# Altium project BMS.PrjPcb
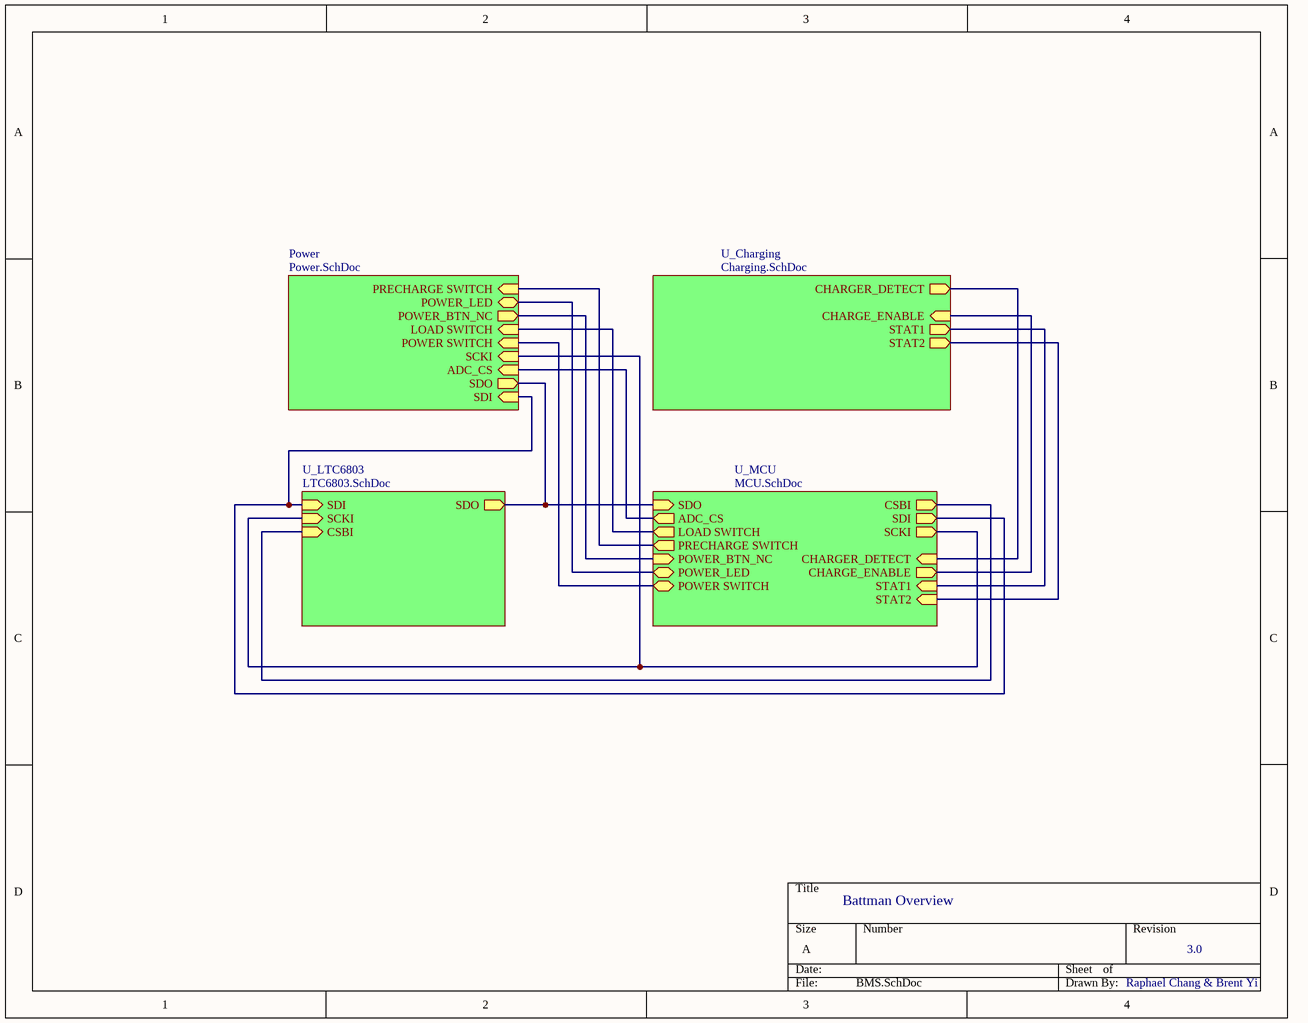
[diagram p0: BMS.SchDoc]
7 sheets, 210 parts. Net scope: hierarchical (ports join the sheet entries above them; power ports are global).
Board file: BMS.PcbDoc
Sheets:
  BMS.SchDoc
    U_LTC6803 = LTC6803.SchDoc
      S12 = Cell.SchDoc
      S11 = Cell.SchDoc
      S10 = Cell.SchDoc
      S9 = Cell.SchDoc
      S8 = Cell.SchDoc
      S7 = Cell.SchDoc
      S6 = Cell.SchDoc
      S5 = Cell.SchDoc
      S4 = Cell.SchDoc
      S3 = Cell.SchDoc
      S2 = Cell.SchDoc
      S1 = Cell.SchDoc
    U_MCU = MCU.SchDoc
    U_Charging = Charging.SchDoc
    Power = Power.SchDoc
      BuckConverter = MAX17502.SchDoc

## Sheet BMS.SchDoc
size A; SheetNumber: 0

### Sub-sheets
Power = Power.SchDoc: PRECHARGE SWITCH (in), POWER_LED, POWER_BTN_NC (out), LOAD SWITCH (in), POWER SWITCH (in), SCKI (in), ADC_CS (in), SDO (out), SDI (in)
U_Charging = Charging.SchDoc: CHARGER_DETECT (out), CHARGE_ENABLE (in), STAT1 (out), STAT2 (out)
U_LTC6803 = LTC6803.SchDoc: SDI (in), SCKI (in), SDO (out), CSBI (in)
U_MCU = MCU.SchDoc: CSBI (out), SDI (out), SDO (in), SCKI (out), CHARGER_DETECT (in), CHARGE_ENABLE (out), STAT1 (in), STAT2 (in), ADC_CS (out), LOAD SWITCH (out), PRECHARGE SWITCH (out), POWER_BTN_NC (in), POWER_LED, POWER SWITCH

### Nets
NetR1_2: sheet U_LTC6803/SCKI, sheet U_MCU/SCKI, sheet Power/SCKI
NetR2_2: sheet U_LTC6803/SDI, sheet U_MCU/SDI, sheet Power/SDI
NetR3_2: sheet U_LTC6803/CSBI, sheet U_MCU/CSBI
NetR50_1: sheet U_MCU/CHARGER_DETECT, sheet U_Charging/CHARGER_DETECT
NetR62_1: sheet U_MCU/POWER_BTN_NC, sheet Power/POWER_BTN_NC
NetR70_1: sheet U_MCU/POWER_LED, sheet Power/POWER_LED
NetU1_43: sheet U_LTC6803/SDO, sheet U_MCU/SDO, sheet Power/SDO
NetU3_12: sheet U_MCU/STAT1, sheet U_Charging/STAT1
NetU3_13: sheet U_MCU/STAT2, sheet U_Charging/STAT2
NetU3_18: sheet U_MCU/PRECHARGE SWITCH, sheet Power/PRECHARGE SWITCH
NetU3_29: sheet U_MCU/CHARGE_ENABLE, sheet U_Charging/CHARGE_ENABLE
NetU3_38: sheet U_MCU/ADC_CS, sheet Power/ADC_CS
NetU3_40: sheet U_MCU/POWER SWITCH, sheet Power/POWER SWITCH
NetU3_41: sheet U_MCU/LOAD SWITCH, sheet Power/LOAD SWITCH

### Notes on the sheet
- Battman Overview
- 3.0
- Raphael Chang & Brent Yi

## Sheet LTC6803.SchDoc
size A
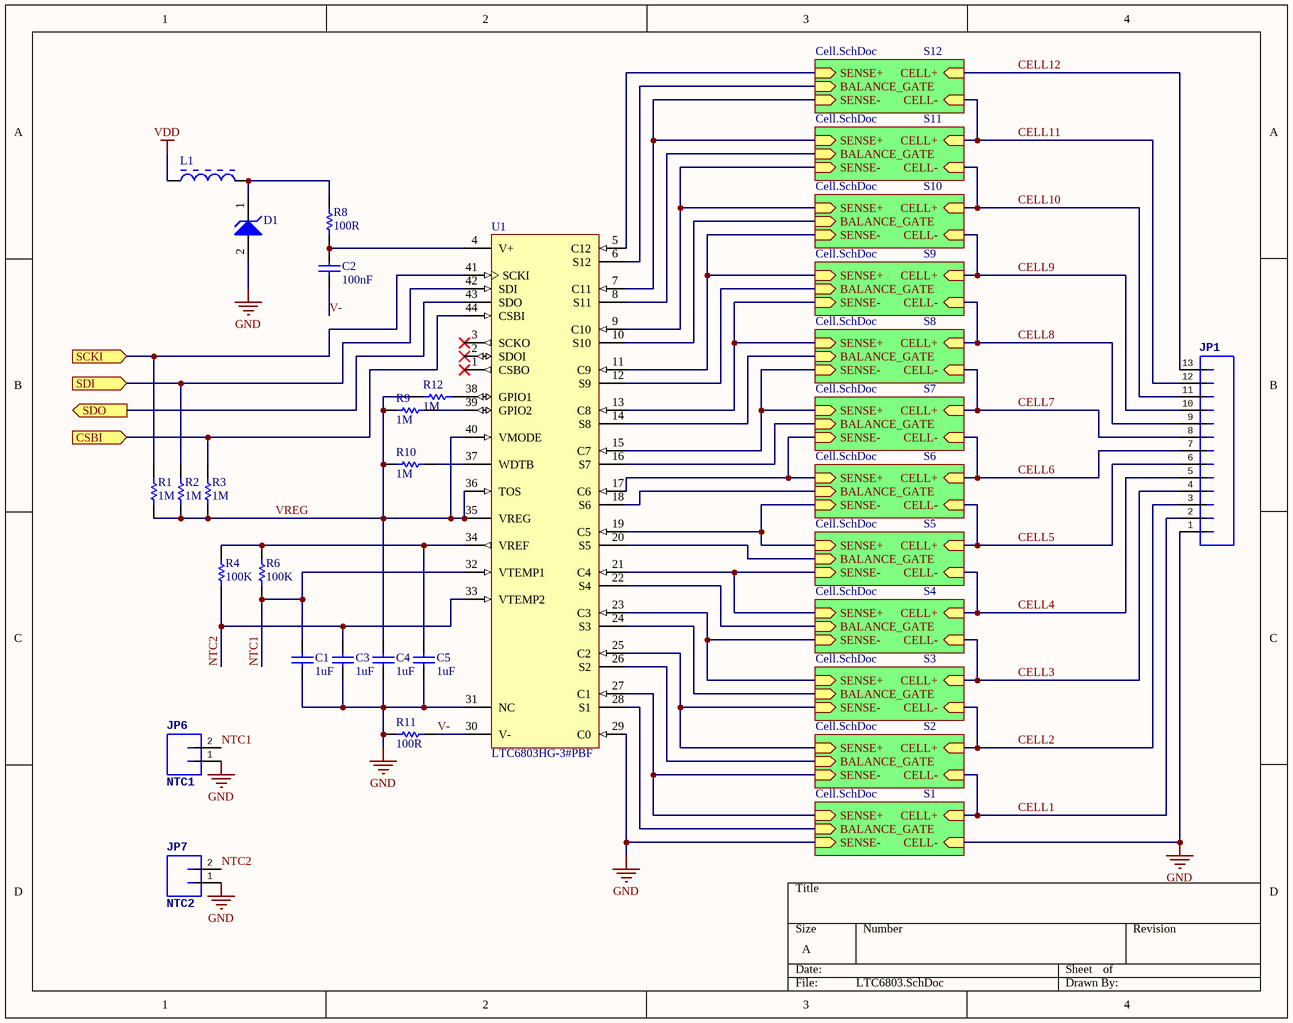
[diagram p1: LTC6803.SchDoc]

### Parts
C1  1uF  [CAPC0603(1608)100_N]
C2  100nF  [CAPC0603(1608)100_L]
C3  1uF  [CAPC0603(1608)100_N]
C4  1uF  [CAPC0603(1608)100_N]
C5  1uF  [CAPC0603(1608)100_N]
D1  (no value)  [SOD-123]
JP1  (no value)  [JST-13-PTH-VERT]
JP6  NTC1  [JST-2-PTH-VERT]
JP7  NTC2  [JST-2-PTH-VERT]
L1  (no value)  [MURA-BLM31-B60-CHIP-2_V3]
R1  1M  [RESC0603(1608)_L]
R2  1M  [RESC0603(1608)_L]
R3  1M  [RESC0603(1608)_L]
R4  100K  [RESC0603(1608)_N]
R6  100K  [RESC0603(1608)_N]
R8  100R  [RESC0603(1608)_L]
R9  1M  [RESC0603(1608)_L]
R10  1M  [RESC0603(1608)_L]
R11  100R  [RESC0603(1608)_L]
R12  1M  [RESC0603(1608)_L]
U1  LTC6803HG-3#PBF  [LT-G-44_L]

### Sub-sheets
S1 = Cell.SchDoc: CELL- (in), SENSE+, SENSE-, BALANCE_GATE (in), CELL+ (in)
S2 = Cell.SchDoc: CELL- (in), SENSE+, SENSE-, BALANCE_GATE (in), CELL+ (in)
S3 = Cell.SchDoc: CELL- (in), SENSE+, SENSE-, BALANCE_GATE (in), CELL+ (in)
S4 = Cell.SchDoc: CELL- (in), SENSE+, SENSE-, BALANCE_GATE (in), CELL+ (in)
S5 = Cell.SchDoc: CELL- (in), SENSE+, SENSE-, BALANCE_GATE (in), CELL+ (in)
S6 = Cell.SchDoc: CELL- (in), SENSE+, SENSE-, BALANCE_GATE (in), CELL+ (in)
S7 = Cell.SchDoc: CELL- (in), SENSE+, SENSE-, BALANCE_GATE (in), CELL+ (in)
S8 = Cell.SchDoc: CELL- (in), SENSE+, SENSE-, BALANCE_GATE (in), CELL+ (in)
S9 = Cell.SchDoc: CELL- (in), SENSE+, SENSE-, BALANCE_GATE (in), CELL+ (in)
S10 = Cell.SchDoc: CELL- (in), SENSE+, SENSE-, BALANCE_GATE (in), CELL+ (in)
S11 = Cell.SchDoc: CELL- (in), SENSE+, SENSE-, BALANCE_GATE (in), CELL+ (in)
S12 = Cell.SchDoc: CELL- (in), SENSE+, SENSE-, BALANCE_GATE (in), CELL+ (in)

### Ports
CSBI (in), SCKI (in), SDI (in), SDO (out)

### Nets
GND: C1.1 C3.1 C4.1 C5.1 D1.2(A) JP1.1 JP6.1 JP7.1 R11.1 U1.29(C0) U1.31(NC) ; sheet S1/CELL-, sheet S1/SENSE-
VDD: L1.1
CELL1: JP1.2 ; sheet S2/CELL-, sheet S1/CELL+
CELL2: JP1.3 ; sheet S3/CELL-, sheet S2/CELL+
CELL3: JP1.4 ; sheet S4/CELL-, sheet S3/CELL+
CELL4: JP1.5 ; sheet S5/CELL-, sheet S4/CELL+
CELL5: JP1.6 ; sheet S6/CELL-, sheet S5/CELL+
CELL6: JP1.7 ; sheet S7/CELL-, sheet S6/CELL+
CELL7: JP1.8 ; sheet S8/CELL-, sheet S7/CELL+
CELL8: JP1.9 ; sheet S9/CELL-, sheet S8/CELL+
CELL9: JP1.10 ; sheet S10/CELL-, sheet S9/CELL+
CELL10: JP1.11 ; sheet S11/CELL-, sheet S10/CELL+
CELL11: JP1.12 ; sheet S12/CELL-, sheet S11/CELL+
CELL12: JP1.13 ; sheet S12/CELL+
NTC1: C1.2 JP6.2 R6.1 U1.32(VTEMP1)
NTC2: C3.2 JP7.2 R4.1 U1.33(VTEMP2)
V-: C2.1 R11.2 U1.30(V-)
VREG: C4.2 R1.1 R2.1 R3.1 R9.1 R10.1 R12.1 U1.35(VREG) U1.36(TOS) U1.40(VMODE)
NetC1_S1_1: U1.27(C1) ; sheet S2/SENSE-, sheet S1/SENSE+
NetC1_S2_1: U1.25(C2) ; sheet S3/SENSE-, sheet S2/SENSE+
NetC1_S3_1: U1.23(C3) ; sheet S4/SENSE-, sheet S3/SENSE+
NetC1_S4_1: U1.21(C4) ; sheet S5/SENSE-, sheet S4/SENSE+
NetC1_S5_1: U1.19(C5) ; sheet S6/SENSE-, sheet S5/SENSE+
NetC1_S6_1: U1.17(C6) ; sheet S7/SENSE-, sheet S6/SENSE+
NetC1_S7_1: U1.15(C7) ; sheet S8/SENSE-, sheet S7/SENSE+
NetC1_S8_1: U1.13(C8) ; sheet S9/SENSE-, sheet S8/SENSE+
NetC1_S9_1: U1.11(C9) ; sheet S10/SENSE-, sheet S9/SENSE+
NetC1_S10_1: U1.9(C10) ; sheet S11/SENSE-, sheet S10/SENSE+
NetC1_S11_1: U1.7(C11) ; sheet S12/SENSE-, sheet S11/SENSE+
NetC1_S12_1: U1.5(C12) ; sheet S12/SENSE+
NetC2_2: C2.2 R8.1 U1.4(V+)
NetC5_2: C5.2 R4.2 R6.2 U1.34(VREF)
NetD1_1: D1.1(K) L1.2 R8.2
NetR1_2: R1.2 U1.41(SCKI) ; port SCKI
NetR2_2: R2.2 U1.42(SDI) ; port SDI
NetR3_2: R3.2 U1.44(CSBI) ; port CSBI
NetR4_S1_1: U1.28(S1) ; sheet S1/BALANCE_GATE
NetR4_S2_1: U1.26(S2) ; sheet S2/BALANCE_GATE
NetR4_S3_1: U1.24(S3) ; sheet S3/BALANCE_GATE
NetR4_S4_1: U1.22(S4) ; sheet S4/BALANCE_GATE
NetR4_S5_1: U1.20(S5) ; sheet S5/BALANCE_GATE
NetR4_S6_1: U1.18(S6) ; sheet S6/BALANCE_GATE
NetR4_S7_1: U1.16(S7) ; sheet S7/BALANCE_GATE
NetR4_S8_1: U1.14(S8) ; sheet S8/BALANCE_GATE
NetR4_S9_1: U1.12(S9) ; sheet S9/BALANCE_GATE
NetR4_S10_1: U1.10(S10) ; sheet S10/BALANCE_GATE
NetR4_S11_1: U1.8(S11) ; sheet S11/BALANCE_GATE
NetR4_S12_1: U1.6(S12) ; sheet S12/BALANCE_GATE
NetR9_2: R9.2 U1.39(GPIO2)
NetR10_2: R10.2 U1.37(WDTB)
NetR12_2: R12.2 U1.38(GPIO1)
NetU1_43: U1.43(SDO) ; port SDO

Not connected (* = marked no-connect by the designer): U1 1(CSBO)* 2(SDOI)* 3(SCKO)*

### Library data of the parts
C1 C3-C5 = CMP-1035-02730-1: CAP 1uF 6.3V Â±10% 0603 (1608 Metric) Thickness 1mm SMD; Case-EIA: 0603; Case-Metric: 1608; Rated Voltage: 6.3 V; Max Thickness: 1 mm; Technology: SMT; Tolerance: Â±10%; Value: 1uF
C2 = CMP-1035-02595-1: CAP 100nF 100V Â±10% 0603 (1608 Metric) Thickness 1mm SMD; Case-EIA: 0603; Case-Metric: 1608; Tolerance: Â±10%; Rated Voltage: 100 V; Value: 100nF; Technology: SMT; Max Thickness: 1 mm
D1 = CMHZ5265B
JP1 = JST_XH_13
JP6 JP7 = JST_2_VERT
L1 = MURA-FB-2
R1-R3 R9 R10 R12 = CMP-1012-00849-1: 1M 0.1W 1% 0603 (1608 Metric)  SMD; Value: 1000000.00 Ohm; Case-EIA: 0603; Case-Metric: 1608; Power: 0.1 W; Tolerance: 1 %; Technology: SMT
R4 R6 = CMP-1012-00122-1: 100K 0.1W 5% 0603 (1608 Metric)  SMD; Case-EIA: 0603; Value: 100000.00 Ohm; Case-Metric: 1608; Tolerance: 5 %; Power: 0.1 W; Technology: SMT
R8 R11 = CMP-1012-00050-1: 100R 0.1W 5% 0603 (1608 Metric)  SMD; Case-EIA: 0603; Value: 100.00 Ohm; Case-Metric: 1608; Tolerance: 5 %; Technology: SMT; Power: 0.1 W
U1 = CMP-0471-00238-1: Multicell Battery Stack Monitor, 60 V Vin MAX, 44-pin SOP (G-44), -40 to 125 degC, Pb-Free; Manufacturer: Linear Technology; Number of Cells: > 1000 V of stacked Li-Ion cells; Vin Max(V): 60; Battery Chemistry: Li-Ion, Supercapacitors, Multi-Chemistry; ComponentLink2URL: http://cds.linear.com/docs/en/datasheet/680313fa.pdf; ComponentLink1URL: http://www.linear.com/; PackageReference: G-44; DatasheetVersion: Rev. A; RoHS: TRUE; Mounting Technology: Surface Mount; ComponentLink3Description: Package Specification; PartNumber: LTC6803HG-3#PBF; Type of Charger: Battery Stack Monitor; PackageVersion: Rev. Ã˜, 06/2010; ComponentLink1Description: Manufacturer URL; PackageDescription: 44-Pin Plastic SSOP, Body 12.8 x 5.3 mm, Pitch 0.5 mm; ComponentLink3URL: http://cds.linear.com/docs/en/packaging/SSOP_44_05-08-1754.pdf; ComponentLink2Description: Datasheet

## Sheet Cell.SchDoc
size A; SheetNumber: 5
Used 12 times, as channels U_LTC6803/S12, U_LTC6803/S11, U_LTC6803/S10, U_LTC6803/S9, U_LTC6803/S8, U_LTC6803/S7, U_LTC6803/S6, U_LTC6803/S5, U_LTC6803/S4, U_LTC6803/S3, U_LTC6803/S2, U_LTC6803/S1. Parts and nets are listed once, with the designators drawn on the sheet.
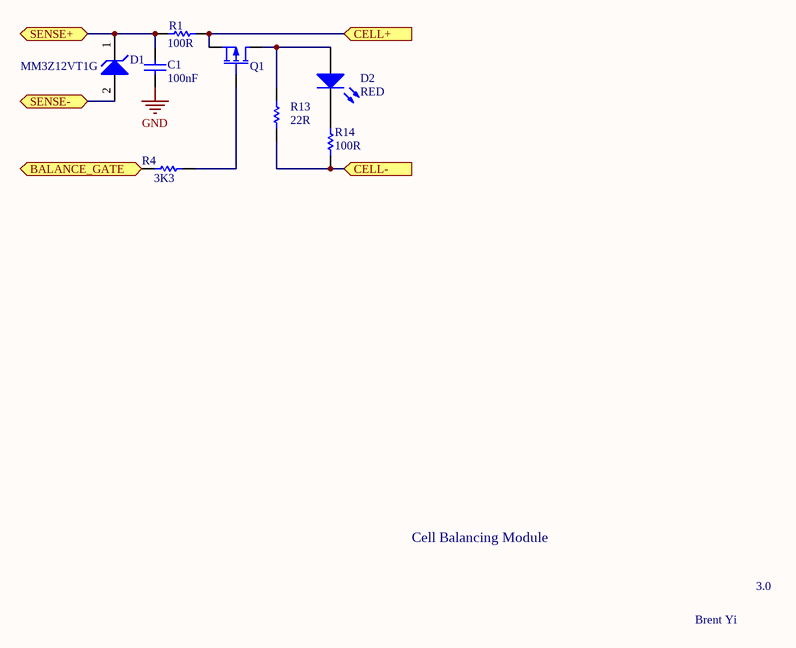
[diagram p2: Cell.SchDoc]

### Parts
C1  100nF  [CAPC0603(1608)100_M]
D1  MM3Z12VT1G  [ONSC-SOD-323-2-477-02_V]
D2  RED  [0603_A]
Q1  SI2365  [SOT23-3]  (value not drawn)
R1  100R  [RESC0603(1608)_N]
R4  3K3  [RESC0603(1608)_N]
R13  value 22R  [RESC2512(6432)_N]
R14  100R  [RESC0603(1608)_N]

### Ports
BALANCE_GATE (in), CELL+ (in), CELL- (in), SENSE+, SENSE- (bidir)

### Nets
GND: C1.2
BALANCE_GATE: R4.1 ; port BALANCE_GATE
CELL+: Q1.3(S) R1.2 ; port CELL+
CELL-: R13.2 R14.1 ; port CELL-
SENSE+: C1.1 D1.1(K) R1.1 ; port SENSE+
SENSE-: D1.2(A) ; port SENSE-
NetD2_1: D2.1(K) R14.2
NetD2_2: D2.2(A) Q1.2(D) R13.1
NetQ1_1: Q1.1(G) R4.2

### Channels
U_LTC6803/S12: designators end in _S12; ports BALANCE_GATE=NetR4_S12_1 CELL+=CELL12 CELL-=CELL11 SENSE+=NetC1_S12_1 SENSE-=NetC1_S11_1
U_LTC6803/S11: designators end in _S11; ports BALANCE_GATE=NetR4_S11_1 CELL+=CELL11 CELL-=CELL10 SENSE+=NetC1_S11_1 SENSE-=NetC1_S10_1
U_LTC6803/S10: designators end in _S10; ports BALANCE_GATE=NetR4_S10_1 CELL+=CELL10 CELL-=CELL9 SENSE+=NetC1_S10_1 SENSE-=NetC1_S9_1
U_LTC6803/S9: designators end in _S9; ports BALANCE_GATE=NetR4_S9_1 CELL+=CELL9 CELL-=CELL8 SENSE+=NetC1_S9_1 SENSE-=NetC1_S8_1
U_LTC6803/S8: designators end in _S8; ports BALANCE_GATE=NetR4_S8_1 CELL+=CELL8 CELL-=CELL7 SENSE+=NetC1_S8_1 SENSE-=NetC1_S7_1
U_LTC6803/S7: designators end in _S7; ports BALANCE_GATE=NetR4_S7_1 CELL+=CELL7 CELL-=CELL6 SENSE+=NetC1_S7_1 SENSE-=NetC1_S6_1
U_LTC6803/S6: designators end in _S6; ports BALANCE_GATE=NetR4_S6_1 CELL+=CELL6 CELL-=CELL5 SENSE+=NetC1_S6_1 SENSE-=NetC1_S5_1
U_LTC6803/S5: designators end in _S5; ports BALANCE_GATE=NetR4_S5_1 CELL+=CELL5 CELL-=CELL4 SENSE+=NetC1_S5_1 SENSE-=NetC1_S4_1
U_LTC6803/S4: designators end in _S4; ports BALANCE_GATE=NetR4_S4_1 CELL+=CELL4 CELL-=CELL3 SENSE+=NetC1_S4_1 SENSE-=NetC1_S3_1
U_LTC6803/S3: designators end in _S3; ports BALANCE_GATE=NetR4_S3_1 CELL+=CELL3 CELL-=CELL2 SENSE+=NetC1_S3_1 SENSE-=NetC1_S2_1
U_LTC6803/S2: designators end in _S2; ports BALANCE_GATE=NetR4_S2_1 CELL+=CELL2 CELL-=CELL1 SENSE+=NetC1_S2_1 SENSE-=NetC1_S1_1
U_LTC6803/S1: designators end in _S1; ports BALANCE_GATE=NetR4_S1_1 CELL+=CELL1 CELL-=GND SENSE+=NetC1_S1_1 SENSE-=GND

### Notes on the sheet
- Cell Balancing Module
- 3.0
- Brent Yi

### Library data of the parts
C1 = CMP-1035-02575-1: CAP 100nF 6.3V Â±5% 0603 (1608 Metric) Thickness 1mm SMD; Case-Metric: 1608; Case-EIA: 0603; Tolerance: Â±5%; Technology: SMT; Rated Voltage: 6.3 V; Max Thickness: 1 mm; Value: 100nF
D1 = CMP-1060-00726-1: Zener Voltage Regulator, 300 mW, 2-Pin SOD-323, Tape and Reel; Manufacturer: On Semiconductor; VZ Typ (V): 12; P Max (W): 0.3; Packing: Tape and Reel; ComponentLink3URL: http://www.onsemi.com/pub_link/Collateral/477-02.PDF.1; ComponentLink2Description: Datasheet; Mounting Technology: Surface Mount; PackageVersion: Rev. H, 03/2007; PackageDescription: 2-Pin SOD, Body 1.7 x 1.25 mm; ComponentLink1URL: http://www.onsemi.com/; ComponentLink1Description: Manufacturer URL; PartNumber: MM3Z12VT1; ComponentLink3Description: Package Specification; ComponentLink2URL: http://www.onsemi.cn/pub_link/Collateral/MM3Z2V4T1-D.PDF; DatasheetVersion: Rev. 9; PackageReference: SOD-323-2-477-02
D2 = CMP-1426-00001-1: SMD mono-color Chip LED, WL-SMCW, Red; Manufacturer: Wuerth Elektronik; PartNumber: 150060RS75000; Color: Red; PackageReference: 0603_A; ComponentLink2URL: http://katalog.we-online.com/led/datasheet/150060RS75000.pdf; ComponentLink1URL: http://www.we-online.com; ComponentLink1Description: Manufacturer URL; ComponentLink2Description: Datasheet
Q1 = MOSFET-P: P-Channel MOSFET; Published: 8-Jun-2000; LatestRevisionDate: 17-Jul-2002; LatestRevisionNote: Re-released for DXP Platform.; PackageVersion: 1995/1996; PackageReference: E3; Publisher: Altium Limited; PackageDescription: TO, Flat Index; 3 In-Line, Axial Leads; Body Dia. 4.6mm; Lead Dia. 0.5 mm (max)
R1 R14 = CMP-1012-00050-1: as R8 on sheet LTC6803; Tolerance: 5 %; Technology: SMT; Power: 0.1 W
R4 = CMP-1012-00086-1: 3K3 0.1W 5% 0603 (1608 Metric)  SMD; Case-EIA: 0603; Value: 3300.00 Ohm; Case-Metric: 1608; Technology: SMT; Tolerance: 5 %; Power: 0.1 W
R13 = CMP-1018-00014-1: 10R 1W 5% 2512 (6432 Metric)  SMD; Case-EIA: 2512; Case-Metric: 6432; Tolerance: 5 %; Technology: SMT; Power: 1 W

## Sheet MCU.SchDoc
size A; SheetNumber: 1
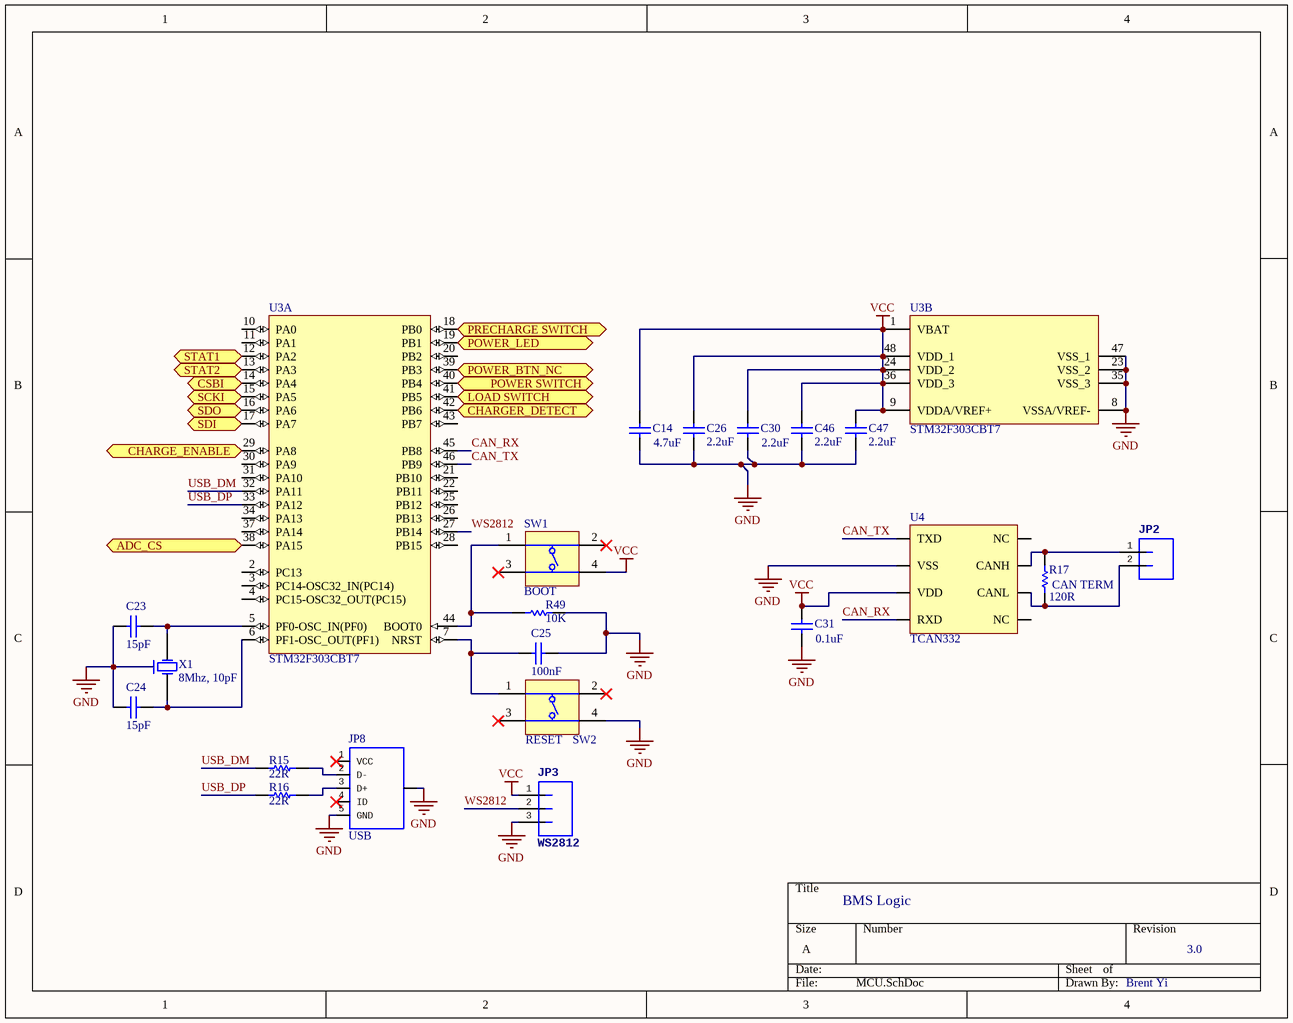
[diagram p3: MCU.SchDoc]

### Parts
C14  4.7uF  [CAPC0603(1608)55_N]
C23  value 15pF  [CAPC0603(1608)55_N]
C24  value 15pF  [CAPC0603(1608)55_N]
C25  value 100nF  [CAPC0603(1608)55_N]
C26  2.2uF  [CAPC0603(1608)55_N]
C30  2.2uF  [CAPC0603(1608)55_N]
C31  value 0.1uF  [CAPC0603(1608)55_N]
C46  2.2uF  [CAPC0603(1608)55_N]
C47  2.2uF  [CAPC0603(1608)55_N]
JP2  (no value)  [JST-2-PTH-VERT]
JP3  WS2812  [JST-3-PTH-VERT]
JP8  USB  [USB-MICROB]
R15  value 22R  [RESC0603(1608)_N]
R16  value 22R  [RESC0603(1608)_N]
R17  CAN TERM  value 120R  [RESC0603(1608)_N]
R49  value 10K  [RESC0603(1608)_N]
SW1  BOOT  [SWITCH]
SW2  RESET  [SWITCH]
U3  STM32F303CBT7  [STM-LQFP48_L]  (parts A,B of 2)
U4  TCAN332  [SOT65P280X145-6N]
X1  8Mhz, 10pF  [ABRA-ABM3B-4_V]

### Ports
ADC_CS (out), CHARGE_ENABLE (out), CHARGER_DETECT (in), CSBI (out), LOAD SWITCH (out), POWER SWITCH, POWER_BTN_NC (in), POWER_LED, PRECHARGE SWITCH (out), SCKI (out), SDI (out), SDO (in), STAT1 (in), STAT2 (in)

### Nets
GND: C14.1 C23.2 C24.2 C25.1 C26.1 C30.1 C31.1 C46.1 C47.1 JP3.3 JP8.5(GND) JP8.6(SHIELD) R49.2 SW2.4(T3) U3.8(VSSA/VREF-) U3.23(VSS_2) U3.35(VSS_3) U3.47(VSS_1) U4.2(VSS) X1.2
VCC: C14.2 C26.2 C30.2 C31.2 C46.2 C47.2 JP3.1 SW1.4(T3) U3.1(VBAT) U3.9(VDDA/VREF+) U3.24(VDD_2) U3.36(VDD_3) U3.48(VDD_1) U4.3(VDD)
CAN_RX: U3.45(PB8) U4.4(RXD)
CAN_TX: U3.46(PB9) U4.1(TXD)
USB_DM: R15.1 U3.32(PA11)
USB_DP: R16.1 U3.33(PA12)
WS2812: JP3.2 U3.27(PB14)
NetC23_1: C23.1 U3.5(PF0-OSC_IN(PF0)) X1.1(X1)
NetC24_1: C24.1 U3.6(PF1-OSC_OUT(PF1)) X1.3(X2)
NetC25_2: C25.2 SW2.1(T1) U3.7(NRST)
NetJP2_1: JP2.1 R17.2 U4.7(CANH)
NetJP2_2: JP2.2 R17.1 U4.6(CANL)
NetJP8_2: JP8.2(D-) R15.2
NetJP8_3: JP8.3(D+) R16.2
NetR1_2: U3.15(PA5) ; port SCKI
NetR2_2: U3.17(PA7) ; port SDI
NetR3_2: U3.14(PA4) ; port CSBI
NetR49_1: R49.1 SW1.1(T1) U3.44(BOOT0)
NetR50_1: U3.42(PB6) ; port CHARGER_DETECT
NetR62_1: U3.39(PB3) ; port POWER_BTN_NC
NetR70_1: U3.19(PB1) ; port POWER_LED
NetU1_43: U3.16(PA6) ; port SDO
NetU3_12: U3.12(PA2) ; port STAT1
NetU3_13: U3.13(PA3) ; port STAT2
NetU3_18: U3.18(PB0) ; port PRECHARGE SWITCH
NetU3_29: U3.29(PA8) ; port CHARGE_ENABLE
NetU3_38: U3.38(PA15) ; port ADC_CS
NetU3_40: U3.40(PB4) ; port POWER SWITCH
NetU3_41: U3.41(PB5) ; port LOAD SWITCH

Not connected (* = marked no-connect by the designer): JP8 1(VCC)* 4(ID)*; SW1 2(T2)* 3(T3)*; SW2 2(T2)* 3(T3)*; U3 2(PC13) 3(PC14-OSC32_IN(PC14)) 4(PC15-OSC32_OUT(PC15)) 10(PA0) 11(PA1) 20(PB2) 21(PB10) 22(PB11) 25(PB12) 26(PB13) 28(PB15) 30(PA9) 31(PA10) 34(PA13) 37(PA14) 43(PB7); U4 5(NC) 8(NC)

### Notes on the sheet
- BMS Logic
- 3.0
- Brent Yi

### Library data of the parts
C14 C23-C26 C30 C31 C46 C47 = CMP-1035-02762-1: CAP 2.2uF 16V Â±10% 0603 (1608 Metric) Thickness 0.55mm SMD; Case-EIA: 0603; Case-Metric: 1608; Max Thickness: 0.55 mm; Technology: SMT; Rated Voltage: 16 V; Tolerance: Â±10%
  C14: Value: 4.7uF
  C26 C30 C46 C47: Value: 2.2uF
JP2 = JST_2_VERT
JP3 = JST_3
JP8 = USB_MICROB_PLUG-SMT: pin to pad: 1>VBUS 2>D- 3>D+ 4>ID 5>GND 6>MT1+P$1+P$2+MT2; PROD_ID: CONN-09900
R15-R17 R49 = CMP-1012-00050-1: 100R 0.1W 5% 0603 (1608 Metric)  SMD; Case-EIA: 0603; Case-Metric: 1608; Tolerance: 5 %; Technology: SMT; Power: 0.1 W
SW1 SW2 = DIPT-DTSM-6: Switch, SPNO Push Button SMD; Manufacturer: Diptronics; PartNumber: DTSM-61NT/R; Packing Type: Tape&Reel; Mechanical Life: 200,000 cycles; ComponentLink2URL: http://www.dip.com.tw/Products_tact.htm; ComponentLink1URL: http://www.dip.com.tw/; ComponentLink3URL: http://www.dip.com.tw/PDF/pro_tact/DTSM_G_-6_2_-V.pdf; PackageDescription: Switch, Through-Hole, 4 Leads, Body 8.5x8.5mm, Row Spacing 9.0mm, Pitch 4.5mm; ComponentLink2Description: Datasheet; ComponentLink3Description: Package Specification; ComponentLink1Description: Manufacturer URL; PackageReference: DTSM-6; Mounting Technology: Through Hole
U3 = CMP-0572-00018-2: ARM Cortex-M4 32-bit MCU, 128 KB Flash, 32 KB Internal RAM, 37 I/Os, 48-pin LQFP, -40 to 105 degC, Tray; Internal RAM Size (kB): 32; Operating Frequency(F) (Processor speed) (MHz): 72; FLASH Size (Prog) (kB): 128; D/A Converter: 2x12-bit (2 Channel); Supply Voltage(Vcc) min (V): 2; I/Os (High Current): 37; PackageReference: LQFP48; Mounting Technology: Surface Mount; PartNumber: STM32F303CBT7; ComponentLink3Description: Package Specification; ComponentLink1Description: Manufacturer URL; ComponentLink1URL: http://www.st.com/web/en/home.html; Packing: Tray; ComponentLink2URL: http://www.st.com/st-web-ui/static/active/en/resource/technical/document/datasheet/DM00058181.pdf; ComponentLink2Description: Datasheet; ComponentLink3URL: http://www.st.com/st-web-ui/static/active/en/resource/technical/document/datasheet/DM00058181.pdf; DatasheetVersion: Rev. 6; PackageDescription: 48-Pin Low Profile Quad Flat Package, 7 x 7 mm Body, 0.5 mm Pitch; PackageVersion: Rev. 6, 06/2013; Core: ARM Cortex-M4; PartId: 1
X1 = ABRA-ABM3B-4

## Sheet Charging.SchDoc
size A
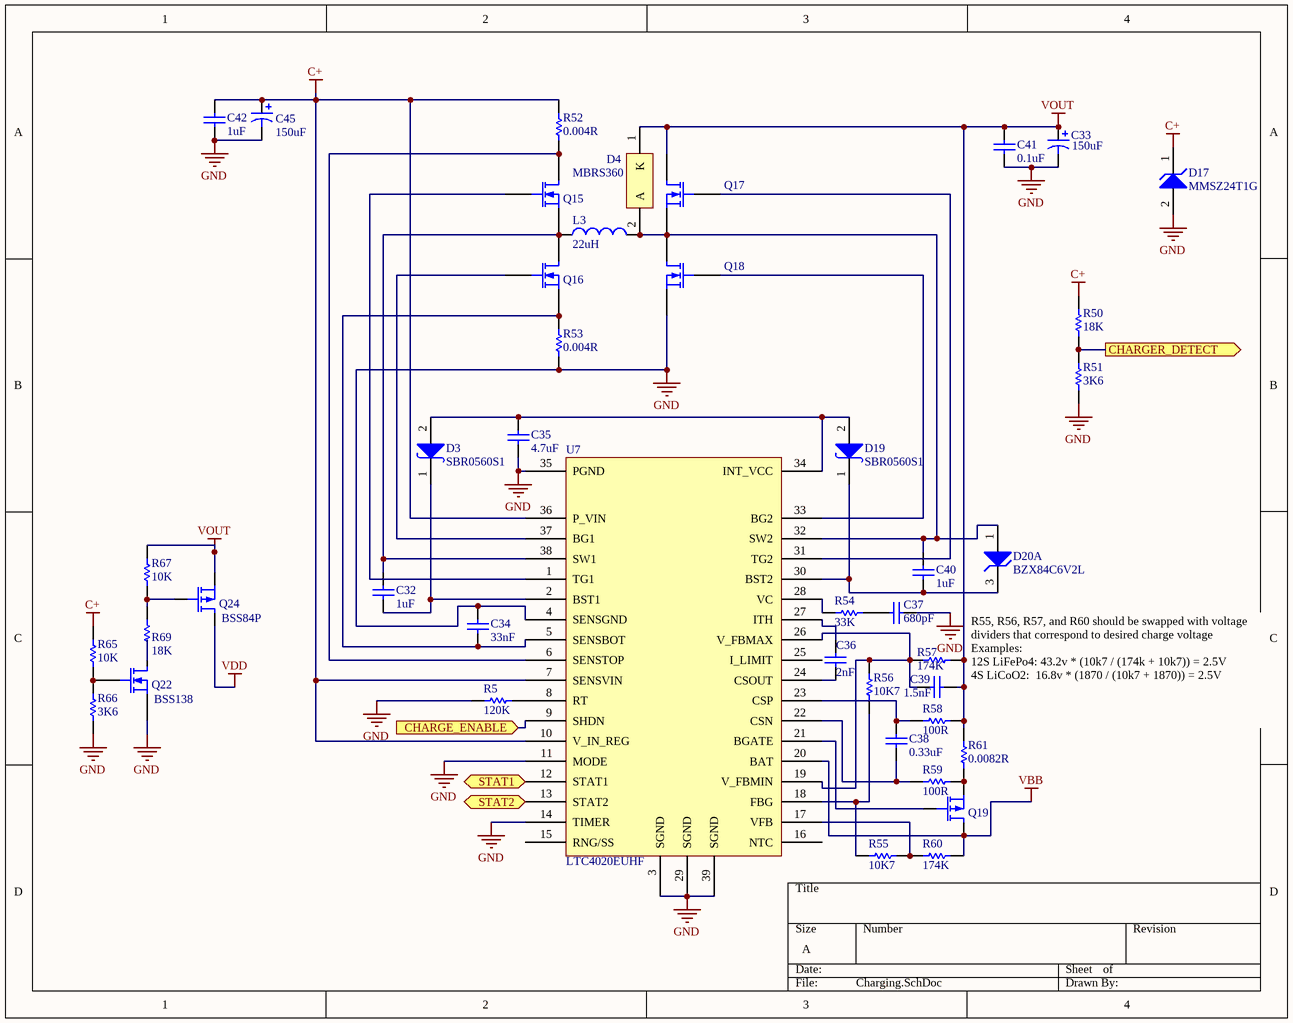
[diagram p4: Charging.SchDoc]

### Parts
C32  1uF  [CAPC0603(1608)100_L]
C33  value 150uF  [CAP 180uF 50V]
C34  33nF  [CAPC0603(1608)100_L]
C35  4.7uF  [CAPC0603(1608)55_L]
C36  2nF  [CAPC0603(1608)100_L]
C37  680pF  [CAPC0603(1608)100_L]
C38  0.33uF  [CAPC0603(1608)100_L]
C39  1.5nF  [CAPC0603(1608)100_N]
C40  1uF  [CAPC0603(1608)100_L]
C41  0.1uF  [CAPC0603(1608)100_L]
C42  1uF  [CAPC0603(1608)100_L]
C45  150uF  [CAP 150uF 25V]
D3  SBR0560S1  [SOD-123]
D4  MBRS360  [ONSC-SMB-2-403A-03_H_V]
D17  MMSZ24T1G  [ONSC-SOD-123-2-425-04_V]
D19  SBR0560S1  [SOD-123]
D20  BZX84C6V2L  [ONSC-SOT-23-3-318-08_V]  (part A of 2)
L3  22uH  [IHLP-6767GZ]
Q15  FDS5672  [SOIC127P600X175-8N]  (value not drawn)
Q16  FDS5672  [SOIC127P600X175-8N]  (value not drawn)
Q17  FDS5672  [SOIC127P600X175-8N]  (value not drawn)
Q18  FDS5672  [SOIC127P600X175-8N]  (value not drawn)
Q19  SQJ461EP-T1  [SOIC127P600X175-8N]  (value not drawn)
Q22  BSS138  [SOT23-3]
Q24  BSS84P  [SOT23-3]
R5  120K  [RESC0603(1608)_L]
R50  18K  [RESC0603(1608)_L]
R51  3K6  [RESC0603(1608)_L]
R52  0.004R  [RESC1206(3216)_L]
R53  0.004R  [RESC1206(3216)_L]
R54  33K  [RESC0603(1608)_N]
R55  10K7  [RESC0603(1608)_L]
R56  10K7  [RESC0603(1608)_L]
R57  174K  [RESC0603(1608)_L]
R58  100R  [RESC0603(1608)_L]
R59  100R  [RESC0603(1608)_L]
R60  174K  [RESC0603(1608)_L]
R61  0.0082R  [RESC2010(5025)_M]
R65  10K  [RESC0603(1608)_N]
R66  3K6  [RESC0603(1608)_N]
R67  10K  [RESC0603(1608)_N]
R69  18K  [RESC0603(1608)_N]
U7  LTC4020EUHF  [QFN38]

### Ports
CHARGE_ENABLE (in), CHARGER_DETECT (out), STAT1 (out), STAT2 (out)

### Nets
C+: C42.2 C45.1 D17.1(K) R50.2 R52.2 R65.2 U7.7(SENSVIN) U7.10(V_IN_REG) U7.36(P_VIN)
GND: C33.2 C34.2 C35.1 C37.2 C41.1 C42.1 C45.2 D17.2(A) Q18.3(S) Q22.3(S) R5.2 R51.1 R53.1 R66.1 U7.3(SGND) U7.4(SENSGND) U7.11(MODE) U7.14(TIMER) U7.29(SGND) U7.35(PGND) U7.39(SGND)
VBB: Q19.2(D) R60.2 U7.20(BAT)
VDD: Q24.2(D)
VOUT: C33.1 C39.2 C41.2 D4.1(K) Q17.2(D) Q24.3(S) R57.2 R58.2 R61.2 R67.2
NetC32_1: C32.1 D3.1(K) U7.2(BST1)
NetC32_2: C32.2 L3.1 Q15.3(S) Q16.2(D) U7.38(SW1)
NetC34_1: C34.1 Q16.3(S) R53.2 U7.5(SENSBOT)
NetC35_2: C35.2 D3.2(A) D19.2(A) U7.34(INT_VCC)
NetC36_1: C36.1 U7.24(CSOUT)
NetC36_2: C36.2 U7.27(ITH)
NetC37_1: C37.1 R54.2
NetC38_1: C38.1 R59.1 U7.22(CSN)
NetC38_2: C38.2 R58.1 U7.23(CSP)
NetC39_1: C39.1 R56.2 R57.1 U7.19(V_FBMIN) U7.26(V_FBMAX)
NetC40_1: C40.1 D19.1(K) D20.3(K) U7.30(BST2)
NetC40_2: C40.2 D4.2(A) D20.1(A) L3.2 Q17.3(S) Q18.2(D) U7.32(SW2)
NetQ15_1: Q15.1(G) U7.1(TG1)
NetQ15_2: Q15.2(D) R52.1 U7.6(SENSTOP)
NetQ16_1: Q16.1(G) U7.37(BG1)
NetQ17_1: Q17.1(G) U7.31(TG2)
NetQ18_1: Q18.1(G) U7.33(BG2)
NetQ19_1: Q19.1(G) U7.21(BGATE)
NetQ19_3: Q19.3(S) R59.2 R61.1
NetQ22_1: Q22.1(G) R65.1 R66.2
NetQ22_2: Q22.2(D) R69.1
NetQ24_1: Q24.1(G) R67.1 R69.2
NetR5_1: R5.1 U7.8(RT)
NetR50_1: R50.1 R51.2 ; port CHARGER_DETECT
NetR54_1: R54.1 U7.28(VC)
NetR55_1: R55.1 R56.1 U7.18(FBG)
NetR55_2: R55.2 R60.1 U7.17(VFB)
NetU3_12: U7.12(STAT1) ; port STAT1
NetU3_13: U7.13(STAT2) ; port STAT2
NetU3_29: U7.9(SHDN) ; port CHARGE_ENABLE

Not connected (* = marked no-connect by the designer): U7 15(RNG/SS) 16(NTC) 25(I_LIMIT)

### Notes on the sheet
- R55, R56, R57, and R60 should be swapped with voltage dividers that correspond to desired charge voltage
  Examples:
  12S LiFePo4: 43.2v * (10k7 / (174k + 10k7)) = 2.5V
  4S LiCoO2:  16.8v * (1870 / (10k7 + 1870)) = 2.5V

### Library data of the parts
C32 C40 C42 = CMP-1035-02740-1: CAP 1uF 25V Â±10% 0603 (1608 Metric) Thickness 1mm SMD; Case-Metric: 1608; Case-EIA: 0603; Technology: SMT; Tolerance: Â±10%; Rated Voltage: 25 V; Max Thickness: 1 mm; Value: 1uF
C33 = CAP 180uF 50V: Polarized Capacitor (Axial); Published: 8-Jun-2000; LatestRevisionDate: 17-Jul-2002; LatestRevisionNote: Re-released for DXP Platform.; PackageReference: POLAR0.8; Publisher: Altium Limited; PackageDescription: Polarized Capacitor; 2 Leads
C34 = CMP-1035-02463-1: CAP 33nF 25V Â±5% 0603 (1608 Metric) Thickness 1mm SMD; Case-Metric: 1608; Case-EIA: 0603; Technology: SMT; Value: 33nF; Max Thickness: 1 mm; Rated Voltage: 25 V; Tolerance: Â±5%
C35 = CMP-1035-02779-1: CAP 4.7uF 6.3V Â±10% 0603 (1608 Metric) Thickness 0.55mm SMD; Case-EIA: 0603; Case-Metric: 1608; Technology: SMT; Tolerance: Â±10%; Value: 4.7uF; Max Thickness: 0.55 mm; Rated Voltage: 6.3 V
C36 = CMP-1035-02018-1: CAP 2.2nF 6.3V Â±5% 0603 (1608 Metric) Thickness 1mm SMD; Case-EIA: 0603; Case-Metric: 1608; Tolerance: Â±5%; Value: 2.2nF; Technology: SMT; Max Thickness: 1 mm; Rated Voltage: 6.3 V
C37 = CMP-1035-01762-1: CAP 680pF 6.3V Â±5% 0603 (1608 Metric) Thickness 1mm SMD; Case-EIA: 0603; Case-Metric: 1608; Technology: SMT; Value: 680pF; Max Thickness: 1 mm; Tolerance: Â±5%; Rated Voltage: 6.3 V
C38 = CMP-1035-02679-1: CAP 330nF 50V Â±10% 0603 (1608 Metric) Thickness 1mm SMD; Case-Metric: 1608; Case-EIA: 0603; Max Thickness: 1 mm; Value: 330nF; Rated Voltage: 50 V; Technology: SMT; Tolerance: Â±10%
C39 = CMP-1035-01943-1: CAP 1.5nF 6.3V Â±5% 0603 (1608 Metric) Thickness 1mm SMD; Case-EIA: 0603; Case-Metric: 1608; Value: 1.5nF; Max Thickness: 1 mm; Rated Voltage: 6.3 V; Technology: SMT; Tolerance: Â±5%
C41 = CMP-1035-02591-1: CAP 100nF 50V Â±5% 0603 (1608 Metric) Thickness 1mm SMD; Case-Metric: 1608; Case-EIA: 0603; Rated Voltage: 50 V; Max Thickness: 1 mm; Tolerance: Â±5%; Technology: SMT; Value: 100nF
C45 = CAP 150uF 25V: Polarized Capacitor (Axial); Published: 8-Jun-2000; LatestRevisionDate: 17-Jul-2002; LatestRevisionNote: Re-released for DXP Platform.; PackageReference: POLAR0.8; Publisher: Altium Limited; PackageDescription: Polarized Capacitor; 2 Leads
D4 = CMP-1055-00339-1: Schottky Power Rectifier, 2-Pin SMB, Pb-Free, Tape and Reel; Manufacturer: On Semiconductor; PartNumber: MBRS360BT3G; Configuration: Single; IFSM Max (A): 125; ComponentLink3Description: Package Specification; ComponentLink2Description: Datasheet; DatasheetVersion: Rev. 8; ComponentLink2URL: http://www.onsemi.cn/pub_link/Collateral/MBRS360T3-D.PDF; ComponentLink3URL: http://www.onsemi.com/pub_link/Collateral/1SMB5913BT3-D.PDF; PackageReference: SMB-2-403A-03_H; PackageVersion: Rev. H, 05/2011; ComponentLink1URL: http://www.onsemi.com/; Packing: Tape and Reel; RoHS: TRUE; PackageDescription: 2-Pin Small Molded Package, J-Bend Lead, Body 4.33 x 3.625 mm; Mounting Technology: Surface Mount; ComponentLink1Description: Manufacturer URL
D17 = CMP-1060-00237-1: Zener Voltage Regulator, 500 mW, 2-Pin SOD-123, Pb-Free, Tape and Reel; Manufacturer: On Semiconductor; P Max (W): 0.5; ComponentLink2URL: http://www.onsemi.com/pub_link/Collateral/MMSZ2V4T1-D.PDF; ComponentLink2Description: Datasheet; RoHS: Pb-Free; Mounting Technology: Surface Mount; PartNumber: MMSZ24T1G; ComponentLink1Description: Manufacturer URL; DatasheetVersion: Rev. 11; PackageReference: SOD-123-2-425-04; PackageDescription: 2-Pin SOD, Body 1.6 x 2.69 mm; PackageVersion: Rev. G, 10/2009; ComponentLink1URL: http://www.onsemi.com/; Packing: Tape and Reel; ComponentLink3URL: http://www.onsemi.com/pub_link/Collateral/425-04.PDF; ComponentLink3Description: Package Specification
D20 = CMP-1060-00911-1: Zener Voltage Regulator, 225 mW, 3-Pin SOT-23, Pb-Free, Tape and Reel; Manufacturer: On Semiconductor; PartNumber: BZX84C6V2LT3G; Packing: Tape and Reel; DatasheetVersion: Rev. 17; ComponentLink1Description: Manufacturer URL; Mounting Technology: Surface Mount; ComponentLink2Description: Datasheet; RoHS: Pb-Free; ComponentLink3Description: Package Specification; ComponentLink3URL: http://www.onsemi.cn/pub_link/Collateral/318-08.PDF; PackageVersion: Rev. AP, 11/2009; ComponentLink1URL: http://www.onsemi.com/; PackageDescription: 3-Pin Small Outline Transistor, Body 2.92 x 1.3 mm, Pitch 0.95 mm; ComponentLink2URL: http://www.onsemi.com/pub_link/Collateral/BZX84C2V4LT1-D.PDF; PackageReference: SOT-23-3-318-08
L3 = IHLP6767: Inductor; Code_IEC: 1005; Published: 8-Jun-2000; LatestRevisionDate: 29-May-2009; LatestRevisionNote: IPC-7351 Footprint Added.; PackageReference: 0402-A; Publisher: Altium Limited; PackageDescription: Chip Inductor; Code_JEITA: 0402
Q15-Q18 = MOSFET-N: N-Channel MOSFET; pin to pad: 1>2 2>3 3>1; Published: 8-Jun-2000; LatestRevisionDate: 17-Jul-2002; LatestRevisionNote: Re-released for DXP Platform.; PackageVersion: 1995/1996; PackageReference: E3; Publisher: Altium Limited; PackageDescription: TO, Flat Index; 3 In-Line, Axial Leads; Body Dia. 4.6mm; Lead Dia. 0.5 mm (max)
Q19 = MOSFET-P: P-Channel MOSFET; pin to pad: 1>2 2>3 3>1; Published: 8-Jun-2000; LatestRevisionDate: 17-Jul-2002; LatestRevisionNote: Re-released for DXP Platform.; PackageVersion: 1995/1996; PackageReference: E3; Publisher: Altium Limited; PackageDescription: TO, Flat Index; 3 In-Line, Axial Leads; Body Dia. 4.6mm; Lead Dia. 0.5 mm (max)
Q22 = MOSFET-N: N-Channel MOSFET; Model: 2N7002; Published: 8-Jun-2000; LatestRevisionDate: 17-Jul-2002; LatestRevisionNote: Re-released for DXP Platform.; PackageVersion: 1995/1996; PackageReference: E3; Publisher: Altium Limited; PackageDescription: TO, Flat Index; 3 In-Line, Axial Leads; Body Dia. 4.6mm; Lead Dia. 0.5 mm (max)
Q24 = MOSFET-P: P-Channel MOSFET; Published: 8-Jun-2000; LatestRevisionDate: 17-Jul-2002; LatestRevisionNote: Re-released for DXP Platform.; PackageVersion: 1995/1996; PackageReference: E3; Publisher: Altium Limited; PackageDescription: TO, Flat Index; 3 In-Line, Axial Leads; Body Dia. 4.6mm; Lead Dia. 0.5 mm (max); Model: BSS84P
R5 = CMP-1012-00124-1: 120K 0.1W 5% 0603 (1608 Metric)  SMD; Value: 120000.00 Ohm; Case-Metric: 1608; Case-EIA: 0603; Power: 0.1 W; Tolerance: 5 %; Technology: SMT
R50 = CMP-1012-00650-1: 18K 0.1W 1% 0603 (1608 Metric)  SMD; Value: 18000.00 Ohm; Case-EIA: 0603; Case-Metric: 1608; Power: 0.1 W; Tolerance: 1 %; Technology: SMT
R51 = CMP-1012-00572-1: 3K6 0.1W 1% 0603 (1608 Metric)  SMD; Case-Metric: 1608; Value: 3600.00 Ohm; Case-EIA: 0603; Tolerance: 1 %; Technology: SMT; Power: 0.1 W
R52 R53 = CMP-1014-00171-1: 1R 0.25W 1% 1206 (3216 Metric)  SMD; Case-EIA: 1206; Value: 1.00 Ohm; Case-Metric: 3216; Technology: SMT; Power: 0.25 W; Tolerance: 1 %
R54 = CMP-1012-00680-1: 33K 0.1W 1% 0603 (1608 Metric)  SMD; Case-EIA: 0603; Value: 33000.00 Ohm; Case-Metric: 1608; Tolerance: 1 %; Power: 0.1 W; Technology: SMT
R55 R56 = CMP-1012-00123-1: 110K 0.1W 5% 0603 (1608 Metric)  SMD; Value: 110000.00 Ohm; Case-Metric: 1608; Case-EIA: 0603; Tolerance: 5 %; Power: 0.1 W; Technology: SMT
R57 R60 = CMP-1012-00152-1: 1M8 0.1W 5% 0603 (1608 Metric)  SMD; Value: 1800000.00 Ohm; Case-Metric: 1608; Case-EIA: 0603; Technology: SMT; Tolerance: 5 %; Power: 0.1 W
R58 R59 = CMP-1012-00050-1: as R8 on sheet LTC6803; Tolerance: 5 %; Technology: SMT; Power: 0.1 W
R61 = CMP-1017-00171-1: 1R 0.75W 1% 2010 (5025 Metric)  SMD; Value: 1.00 Ohm; Case-Metric: 5025; Case-EIA: 2010; Technology: SMT; Tolerance: 1 %; Power: 0.75 W
R65 R67 = CMP-1012-00098-1: 10K 0.1W 5% 0603 (1608 Metric)  SMD; Case-EIA: 0603; Value: 10000.00 Ohm; Case-Metric: 1608; Technology: SMT; Tolerance: 5 %; Power: 0.1 W
R66 = CMP-1012-00087-1: 3K6 0.1W 5% 0603 (1608 Metric)  SMD; Case-EIA: 0603; Case-Metric: 1608; Value: 3600.00 Ohm; Technology: SMT; Power: 0.1 W; Tolerance: 5 %
R69 = CMP-1012-00098-1: 18K 0.1W 5% 0603 (1608 Metric)  SMD; Case-EIA: 0603; Value: 10000.00 Ohm; Case-Metric: 1608; Technology: SMT; Tolerance: 5 %; Power: 0.1 W

## Sheet Power.SchDoc
size A; SheetNumber: 2
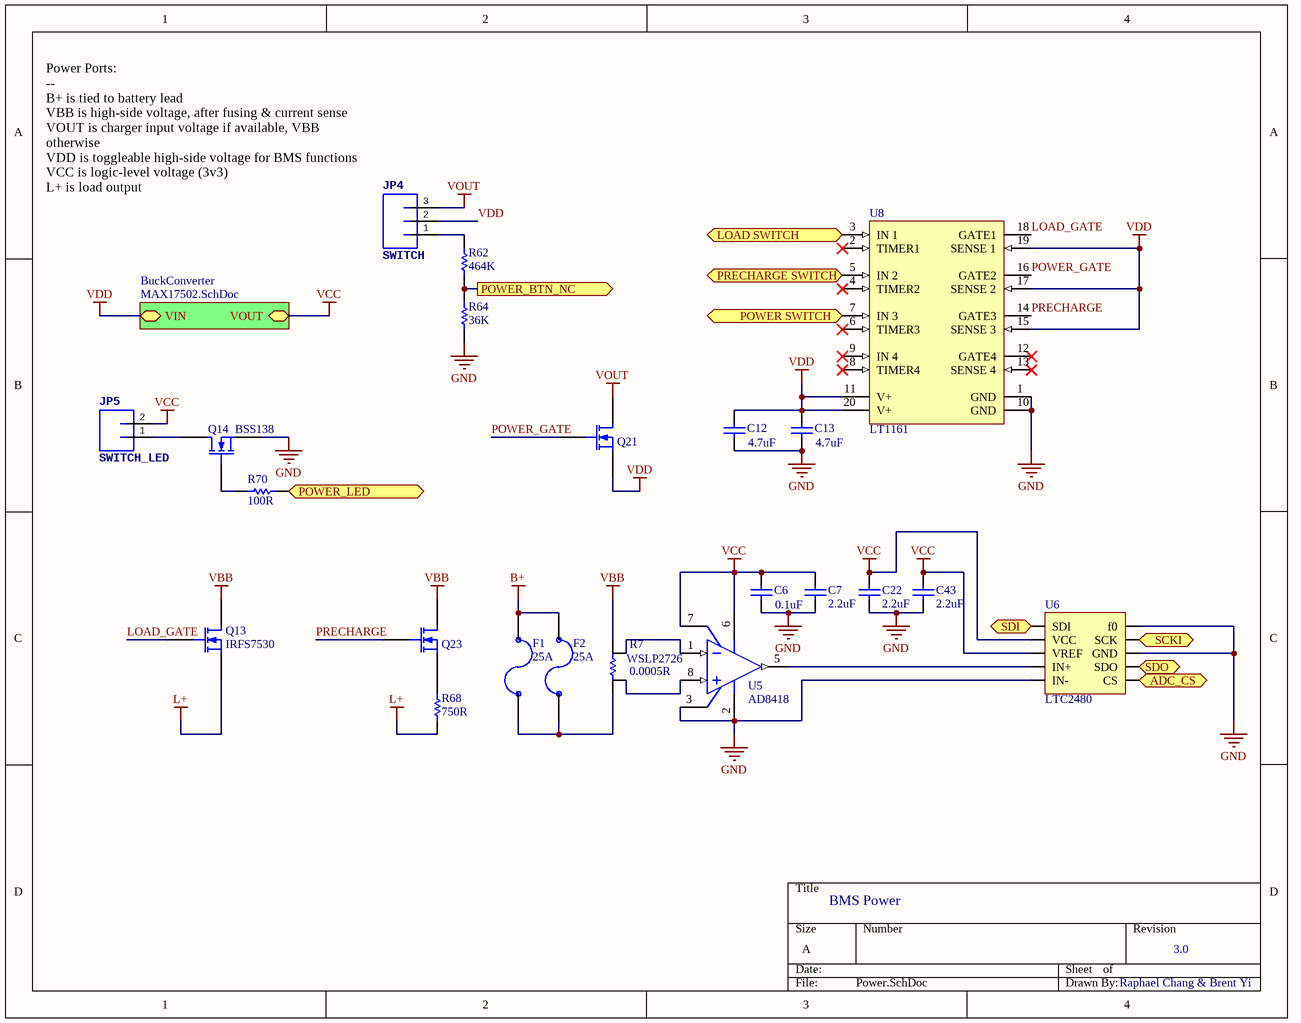
[diagram p5: Power.SchDoc]

### Parts
C6  0.1uF  [CAPC0603(1608)55_N]
C7  value 2.2uF  [CAPC0603(1608)100_N]
C12  value 4.7uF  [CAPC1210(3225)280_N]
C13  value 4.7uF  [CAPC1210(3225)280_N]
C22  2.2uF  [CAPC0603(1608)55_N]
C43  2.2uF  [CAPC0603(1608)55_N]
F1  25A  [1206_FUSE]
F2  25A  [1206_FUSE]
JP4  SWITCH  [JST-3-PTH-VERT]
JP5  SWITCH_LED  [JST-2-PTH-VERT]
Q13  IRFS7530  [DPAK127P1525X483-7N]
Q14  BSS138  [SOT23-3]
Q21  FDS5672  [SOIC127P600X175-8N]  (value not drawn)
Q23  BSS138  [SOT23-3]  (value not drawn)
R7  WSLP2726  value 0.0005R  [WSL2726]
R62  464K  [RESC0603(1608)_L]
R64  36K  [RESC0603(1608)_L]
R68  750R  [RESC2512(6432)_N]
R70  100R  [RESC0603(1608)_L]
U5  AD8418  [MSOP-8]
U6  LTC2480  [MSOP10]
U8  LT1161  [LT-SW-20_M]

### Sub-sheets
BuckConverter = MAX17502.SchDoc: VIN, VOUT

### Ports
ADC_CS (in), LOAD SWITCH (in), POWER SWITCH (in), POWER_BTN_NC (out), POWER_LED, PRECHARGE SWITCH (in), SCKI (in), SDI (in), SDO (out)

### Nets
B+: F1.1 F2.1
GND: C6.2 C7.2 C12.1 C13.1 C22.1 C43.1 Q14.3(S) R64.1 U5.2(GND) U5.3(VREF2) U6.4(IN-) U6.5(f0) U6.7(GND) U8.1(GND) U8.10(GND)
L+: Q13.3(S) R68.1
VBB: Q13.2(D) Q23.2(D) R7.2
VCC: C6.1 C7.1 C22.2 C43.2 JP5.2 U5.6(VS) U5.7(VREF1) U6.1(VCC) U6.2(VREF) ; sheet BuckConverter/VOUT
VDD: C12.2 C13.2 JP4.2 Q21.3(S) U8.11(V+) U8.15(SENSE_3) U8.17(SENSE_2) U8.19(SENSE_1) U8.20(V+) ; sheet BuckConverter/VIN
VOUT: JP4.3 Q21.2(D)
LOAD_GATE: Q13.1(G) U8.18(GATE1)
POWER_GATE: Q21.1(G) U8.16(GATE2)
PRECHARGE: Q23.1(G) U8.14(GATE3)
NetF1_2: F1.2 F2.2 R7.1
NetJP4_1: JP4.1 R62.2
NetJP5_1: JP5.1 Q14.2(D)
NetQ14_1: Q14.1(G) R70.2
NetQ23_3: Q23.3(S) R68.2
NetR1_2: U6.6(SCK) ; port SCKI
NetR2_2: U6.0(SDI) ; port SDI
NetR7_3: R7.3 U5.8(IN+)
NetR7_4: R7.4 U5.1(IN-)
NetR62_1: R62.1 R64.2 ; port POWER_BTN_NC
NetR70_1: R70.1 ; port POWER_LED
NetU1_43: U6.8(SDO) ; port SDO
NetU3_18: U8.5(IN_2) ; port PRECHARGE SWITCH
NetU3_38: U6.9(CS) ; port ADC_CS
NetU3_40: U8.7(IN_3) ; port POWER SWITCH
NetU3_41: U8.3(IN_1) ; port LOAD SWITCH
NetU5_5: U5.5(OUT) U6.3(IN+)

Not connected (* = marked no-connect by the designer): U8 2(TIMER1)* 4(TIMER2)* 6(TIMER3)* 8(TIMER4)* 9(IN_4)* 12(GATE4)* 13(SENSE_4)*

### Notes on the sheet
- (near JP4) Power Ports:
  --
  B+ is tied to battery lead
  VBB is high-side voltage, after fusing & current sense
  VOUT is charger input voltage if available, VBB otherwise
  VDD is toggleable high-side voltage for BMS functions
  VCC is logic-level voltage (3v3)
  L+ is load output
- BMS Power
- 3.0
- Raphael Chang & Brent Yi

### Library data of the parts
C6 = CMP-1035-02762-1: as C14 on sheet MCU; Max Thickness: 0.55 mm; Technology: SMT; Value: 0.1uF; Rated Voltage: 16 V; Tolerance: Â±10%
C7 = CMP-1035-02730-1: as C1 on sheet LTC6803; Rated Voltage: 6.3 V; Max Thickness: 1 mm; Technology: SMT; Tolerance: Â±10%
C12 C13 = CMP-1038-02301-1: CAP 100uF 10V Â±10% 1210 (3225 Metric) Thickness 2.8mm SMD; Case-EIA: 1210; Case-Metric: 3225; Rated Voltage: 6.3 V; Tolerance: Â±10%; Technology: SMT; Max Thickness: 2.8 mm
C22 C43 = CMP-1035-02751-1: CAP 2.2uF 4V Â±10% 0603 (1608 Metric) Thickness 0.55mm SMD; Case-EIA: 0603; Case-Metric: 1608; Tolerance: Â±10%; Rated Voltage: 4 V; Technology: SMT; Max Thickness: 0.55 mm; Value: 2.2uF
F1 F2 = FUSE 1206: Fuse; Supplier 1: Allied; Supplier Part Number 1: 70160157
JP4 = JST_3
JP5 = JST_2_VERT
Q13 Q14 Q23 = MOSFET-N: N-Channel MOSFET; Published: 8-Jun-2000; LatestRevisionDate: 17-Jul-2002; LatestRevisionNote: Re-released for DXP Platform.; PackageVersion: 1995/1996; PackageReference: E3; Publisher: Altium Limited; PackageDescription: TO, Flat Index; 3 In-Line, Axial Leads; Body Dia. 4.6mm; Lead Dia. 0.5 mm (max)
Q21 = MOSFET-N: N-Channel MOSFET; pin to pad: 1>2 2>3 3>1; Published: 8-Jun-2000; LatestRevisionDate: 17-Jul-2002; LatestRevisionNote: Re-released for DXP Platform.; PackageVersion: 1995/1996; PackageReference: E3; Publisher: Altium Limited; PackageDescription: TO, Flat Index; 3 In-Line, Axial Leads; Body Dia. 4.6mm; Lead Dia. 0.5 mm (max)
R7 = WSLP2726: Resistor; Published: 8-Jun-2000; LatestRevisionDate: 17-Jul-2002; LatestRevisionNote: Re-released for DXP Platform.; PackageReference: AXIAL-0.3; Publisher: Altium Limited; PackageDescription: Axial Device, Thru-Hole; 2 Leads; 0.3 in Pin Spacing
R62 = CMP-1012-00811-1: 464K 0.1W 1% 0603 (1608 Metric)  SMD; Value: 464000.00 Ohm; Case-Metric: 1608; Case-EIA: 0603; Tolerance: 1 %; Power: 0.1 W; Technology: SMT
R64 = CMP-1012-00685-1: 36K 0.1W 1% 0603 (1608 Metric)  SMD; Case-Metric: 1608; Value: 36000.00 Ohm; Case-EIA: 0603; Technology: SMT; Power: 0.1 W; Tolerance: 1 %
R68 = CMP-1018-00496-1: 750R 1W 1% 2512 (6432 Metric)  SMD; Value: 750.00 Ohm; Case-EIA: 2512; Case-Metric: 6432; Tolerance: 1 %; Technology: SMT; Power: 1 W
R70 = CMP-1012-00050-1: as R15 on sheet MCU; Tolerance: 5 %; Technology: SMT; Value: 100R; Power: 0.1 W
U8 = CMP-0479-00631-1: Quad Protected High-Side MOSFET Driver, 8 to 48 V Vin, 20-pin SOIC (SW-20), -40 to 85 degC, Pb-Free; Manufacturer: Linear Technology; PartNumber: LT1161ISW#PBF; ComponentLink3URL: http://cds.linear.com/docs/en/packaging/SO_20_05-08-1620.pdf; RoHS: TRUE; ComponentLink1URL: http://www.linear.com/; PackageDescription: 20-Pin Plastic Small Outline, Body 12.80 x 7.49 mm, Pitch 1.27 mm; DatasheetVersion: Rev. A; ComponentLink1Description: Manufacturer URL; ComponentLink3Description: Package Specification; ComponentLink2URL: http://cds.linear.com/docs/en/datasheet/1161fa.pdf; PackageReference: SW-20; PackageVersion: Jun-10; ComponentLink2Description: Datasheet; Mounting Technology: Surface Mount

## Sheet MAX17502.SchDoc
size A; SheetNumber: 6
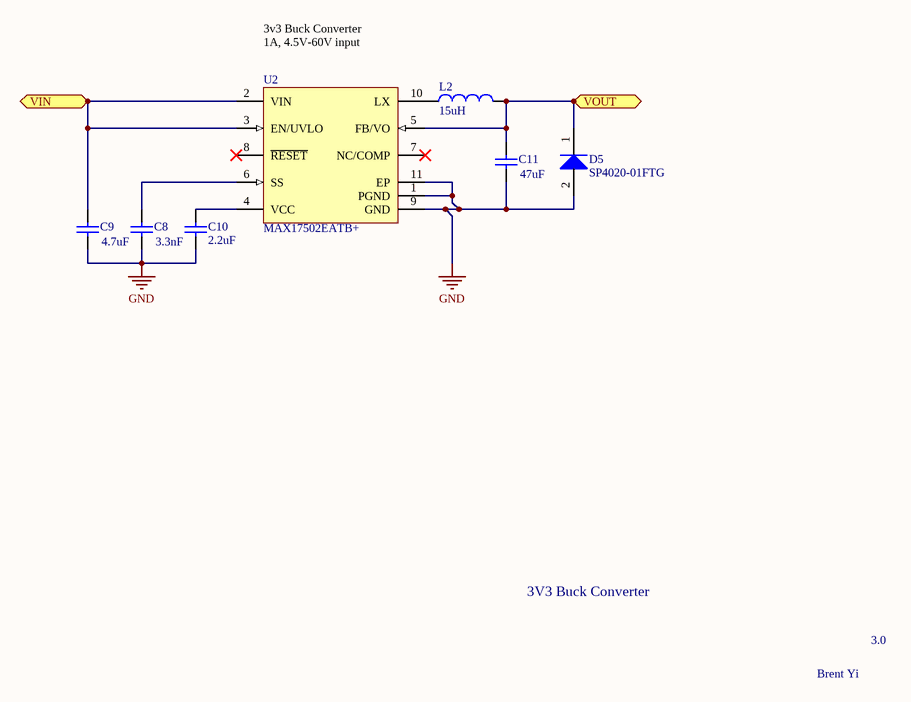
[diagram p6: MAX17502.SchDoc]

### Parts
C8  value 3.3nF  [CAPC0603(1608)55_N]
C9  value 4.7uF  [CAPC1210(3225)280_N]
C10  value 2.2uF  [CAPC0603(1608)100_N]
C11  value 47uF  [CAPC1210(3225)280_N]
D5  SP4020-01FTG  [SOD323]
L2  value 15uH  [SDR0604]  (hidden comment: SDR0805-180ML)
U2  MAX17502EATB+  [MAXM-T1032N+1_V]

### Ports
VIN, VOUT

### Nets
GND: C8.2 C9.1 C10.2 C11.1 D5.2(A) U2.1(PGND) U2.9(GND) U2.11(EP)
VCC: C11.2 D5.1(K) L2.2 U2.5(FB/VO) ; port VOUT
VDD: C9.2 U2.2(VIN) U2.3(EN/UVLO) ; port VIN
NetC8_1: C8.1 U2.6(SS)
NetC10_1: C10.1 U2.4(VCC)
NetL2_1: L2.1 U2.10(LX)

Not connected (* = marked no-connect by the designer): U2 7(NC/COMP)* 8(~{RESET})*

### Notes on the sheet
- 3v3 Buck Converter
  1A, 4.5V-60V input
- 3V3 Buck Converter
- 3.0
- Brent Yi

### Library data of the parts
C8 = CMP-1035-02762-1: CAP 2.2uF 16V Â±10% 0603 (1608 Metric) Thickness 0.55mm SMD; Rated Voltage: 50V; Case-EIA: 0603; Case-Metric: 1608; Max Thickness: 0.55 mm; Technology: SMT; Tolerance: Â±10%
C9 C11 = CMP-1038-02301-1: as C12 on sheet Power; Tolerance: Â±10%; Technology: SMT; Max Thickness: 2.8 mm
C10 = CMP-1035-02730-1: CAP 1uF 6.3V Â±10% 0603 (1608 Metric) Thickness 1mm SMD; Case-EIA: 0603; Rated Voltage: 50V; Case-Metric: 1608; Max Thickness: 1 mm; Technology: SMT; Tolerance: Â±10%
D5 = SP4020-01FTG: PartNumber: MMSZ5262BT1G; Manufacturer: On Semiconductor; P Max (W): 0.5; Packing: Tape and Reel; VZ Typ (V): 51; PackageVersion: Rev. G, 10/2009; ComponentLink3Description: Package Specification; PackageReference: SOD-123-2-425-04; PackageDescription: 2-Pin SOD, Body 1.6 x 2.69 mm; ComponentLink1Description: Manufacturer URL; ComponentLink2Description: Datasheet; DatasheetVersion: Rev. 12; Mounting Technology: Surface Mount; RoHS: Pb-Free; ComponentLink1URL: http://www.onsemi.com/; ComponentLink3URL: http://www.onsemi.com/pub_link/Collateral/425-04.PDF; ComponentLink2URL: http://www.onsemi.com/pub_link/Collateral/MMSZ5221BT1-D.PDF
L2 = SDR0805-180ML: Inductor; Code_IEC: 1005; Published: 8-Jun-2000; LatestRevisionDate: 29-May-2009; LatestRevisionNote: IPC-7351 Footprint Added.; PackageReference: 0402-A; Publisher: Altium Limited; PackageDescription: Chip Inductor; Code_JEITA: 0402
U2 = CMP-1264-00007-1: Ultra-Small, High-Efficiency, Synchronous Step-Down DC-DC Converter, 4.5 to 60 V, 1 A, -40 to 125 degC, 10-Pin TDFN (T1032N+1), RoHS, Tube; Manufacturer: Maxim; IOUT: 1 A Max.; VOUT: 3.3 V; DC-DC Outputs: 1; FSW: 600 KHz Typ.; VCC: 4.65 to 5.35 V; IEN: 8 nA Typ.; Operating Temperature Range: -40 to 125 degC; Mounting Technology: Surface Mount; ComponentLink2Description: Datasheet; PackageVersion: Rev. C; ComponentLink2URL: http://datasheets.maximintegrated.com/en/ds/MAX17502.pdf; Packing: Tube; RoHS: TRUE; PartNumber: MAX17502EATB+; PackageDescription: 10-Pin TDFN, Body 3 x 2 mm, Pitch 0.5 mm; ComponentLink3URL: http://pdfserv.maximintegrated.com/package_dwgs/21-0429.PDF; DatasheetVersion: Rev. 2; ComponentLink1Description: Manufacturer URL; ComponentLink1URL: http://www.maximintegrated.com/en.html; ComponentLink3Description: Package Specification; VIN: 4.5 to 60 V

## Nets that join several sheets
GND: LTC6803 (11 pins), U_LTC6803/S12 (C1_S12.2), U_LTC6803/S11 (C1_S11.2), U_LTC6803/S10 (C1_S10.2), U_LTC6803/S9 (C1_S9.2), U_LTC6803/S8 (C1_S8.2), U_LTC6803/S7 (C1_S7.2), U_LTC6803/S6 (C1_S6.2), U_LTC6803/S5 (C1_S5.2), U_LTC6803/S4 (C1_S4.2), U_LTC6803/S3 (C1_S3.2), U_LTC6803/S2 (C1_S2.2), U_LTC6803/S1 (C1_S1.2 D1_S1.2 R13_S1.2 R14_S1.1), MCU (20 pins), Charging (21 pins), Power (15 pins), MAX17502 (8 pins)
VBB: Charging (Q19.2 R60.2 U7.20), Power (Q13.2 Q23.2 R7.2)
VCC: MCU (14 pins), Power (9 pins), MAX17502 (C11.2 D5.1 L2.2 U2.5)
VDD: LTC6803 (L1.1), Charging (Q24.2), Power (9 pins), MAX17502 (C9.2 U2.2 U2.3)
VOUT: Charging (10 pins), Power (JP4.3 Q21.2)
CELL1: LTC6803 (JP1.2), U_LTC6803/S2 (R13_S2.2 R14_S2.1), U_LTC6803/S1 (Q1_S1.3 R1_S1.2)
CELL2: LTC6803 (JP1.3), U_LTC6803/S3 (R13_S3.2 R14_S3.1), U_LTC6803/S2 (Q1_S2.3 R1_S2.2)
CELL3: LTC6803 (JP1.4), U_LTC6803/S4 (R13_S4.2 R14_S4.1), U_LTC6803/S3 (Q1_S3.3 R1_S3.2)
CELL4: LTC6803 (JP1.5), U_LTC6803/S5 (R13_S5.2 R14_S5.1), U_LTC6803/S4 (Q1_S4.3 R1_S4.2)
CELL5: LTC6803 (JP1.6), U_LTC6803/S6 (R13_S6.2 R14_S6.1), U_LTC6803/S5 (Q1_S5.3 R1_S5.2)
CELL6: LTC6803 (JP1.7), U_LTC6803/S7 (R13_S7.2 R14_S7.1), U_LTC6803/S6 (Q1_S6.3 R1_S6.2)
CELL7: LTC6803 (JP1.8), U_LTC6803/S8 (R13_S8.2 R14_S8.1), U_LTC6803/S7 (Q1_S7.3 R1_S7.2)
CELL8: LTC6803 (JP1.9), U_LTC6803/S9 (R13_S9.2 R14_S9.1), U_LTC6803/S8 (Q1_S8.3 R1_S8.2)
CELL9: LTC6803 (JP1.10), U_LTC6803/S10 (R13_S10.2 R14_S10.1), U_LTC6803/S9 (Q1_S9.3 R1_S9.2)
CELL10: LTC6803 (JP1.11), U_LTC6803/S11 (R13_S11.2 R14_S11.1), U_LTC6803/S10 (Q1_S10.3 R1_S10.2)
CELL11: LTC6803 (JP1.12), U_LTC6803/S12 (R13_S12.2 R14_S12.1), U_LTC6803/S11 (Q1_S11.3 R1_S11.2)
CELL12: LTC6803 (JP1.13), U_LTC6803/S12 (Q1_S12.3 R1_S12.2)
NetC1_S1_1: LTC6803 (U1.27), U_LTC6803/S2 (D1_S2.2), U_LTC6803/S1 (C1_S1.1 D1_S1.1 R1_S1.1)
NetC1_S2_1: LTC6803 (U1.25), U_LTC6803/S3 (D1_S3.2), U_LTC6803/S2 (C1_S2.1 D1_S2.1 R1_S2.1)
NetC1_S3_1: LTC6803 (U1.23), U_LTC6803/S4 (D1_S4.2), U_LTC6803/S3 (C1_S3.1 D1_S3.1 R1_S3.1)
NetC1_S4_1: LTC6803 (U1.21), U_LTC6803/S5 (D1_S5.2), U_LTC6803/S4 (C1_S4.1 D1_S4.1 R1_S4.1)
NetC1_S5_1: LTC6803 (U1.19), U_LTC6803/S6 (D1_S6.2), U_LTC6803/S5 (C1_S5.1 D1_S5.1 R1_S5.1)
NetC1_S6_1: LTC6803 (U1.17), U_LTC6803/S7 (D1_S7.2), U_LTC6803/S6 (C1_S6.1 D1_S6.1 R1_S6.1)
NetC1_S7_1: LTC6803 (U1.15), U_LTC6803/S8 (D1_S8.2), U_LTC6803/S7 (C1_S7.1 D1_S7.1 R1_S7.1)
NetC1_S8_1: LTC6803 (U1.13), U_LTC6803/S9 (D1_S9.2), U_LTC6803/S8 (C1_S8.1 D1_S8.1 R1_S8.1)
NetC1_S9_1: LTC6803 (U1.11), U_LTC6803/S10 (D1_S10.2), U_LTC6803/S9 (C1_S9.1 D1_S9.1 R1_S9.1)
NetC1_S10_1: LTC6803 (U1.9), U_LTC6803/S11 (D1_S11.2), U_LTC6803/S10 (C1_S10.1 D1_S10.1 R1_S10.1)
NetC1_S11_1: LTC6803 (U1.7), U_LTC6803/S12 (D1_S12.2), U_LTC6803/S11 (C1_S11.1 D1_S11.1 R1_S11.1)
NetC1_S12_1: LTC6803 (U1.5), U_LTC6803/S12 (C1_S12.1 D1_S12.1 R1_S12.1)
NetR1_2: LTC6803 (R1.2 U1.41), MCU (U3.15), Power (U6.6)
NetR2_2: LTC6803 (R2.2 U1.42), MCU (U3.17), Power (U6.0)
NetR3_2: LTC6803 (R3.2 U1.44), MCU (U3.14)
NetR4_S1_1: LTC6803 (U1.28), U_LTC6803/S1 (R4_S1.1)
NetR4_S2_1: LTC6803 (U1.26), U_LTC6803/S2 (R4_S2.1)
NetR4_S3_1: LTC6803 (U1.24), U_LTC6803/S3 (R4_S3.1)
NetR4_S4_1: LTC6803 (U1.22), U_LTC6803/S4 (R4_S4.1)
NetR4_S5_1: LTC6803 (U1.20), U_LTC6803/S5 (R4_S5.1)
NetR4_S6_1: LTC6803 (U1.18), U_LTC6803/S6 (R4_S6.1)
NetR4_S7_1: LTC6803 (U1.16), U_LTC6803/S7 (R4_S7.1)
NetR4_S8_1: LTC6803 (U1.14), U_LTC6803/S8 (R4_S8.1)
NetR4_S9_1: LTC6803 (U1.12), U_LTC6803/S9 (R4_S9.1)
NetR4_S10_1: LTC6803 (U1.10), U_LTC6803/S10 (R4_S10.1)
NetR4_S11_1: LTC6803 (U1.8), U_LTC6803/S11 (R4_S11.1)
NetR4_S12_1: LTC6803 (U1.6), U_LTC6803/S12 (R4_S12.1)
NetR50_1: MCU (U3.42), Charging (R50.1 R51.2)
NetR62_1: MCU (U3.39), Power (R62.1 R64.2)
NetR70_1: MCU (U3.19), Power (R70.1)
NetU1_43: LTC6803 (U1.43), MCU (U3.16), Power (U6.8)
NetU3_12: MCU (U3.12), Charging (U7.12)
NetU3_13: MCU (U3.13), Charging (U7.13)
NetU3_18: MCU (U3.18), Power (U8.5)
NetU3_29: MCU (U3.29), Charging (U7.9)
NetU3_38: MCU (U3.38), Power (U6.9)
NetU3_40: MCU (U3.40), Power (U8.7)
NetU3_41: MCU (U3.41), Power (U8.3)